# EAGLE design ATtinyNode (EAGLE 9.3.1)
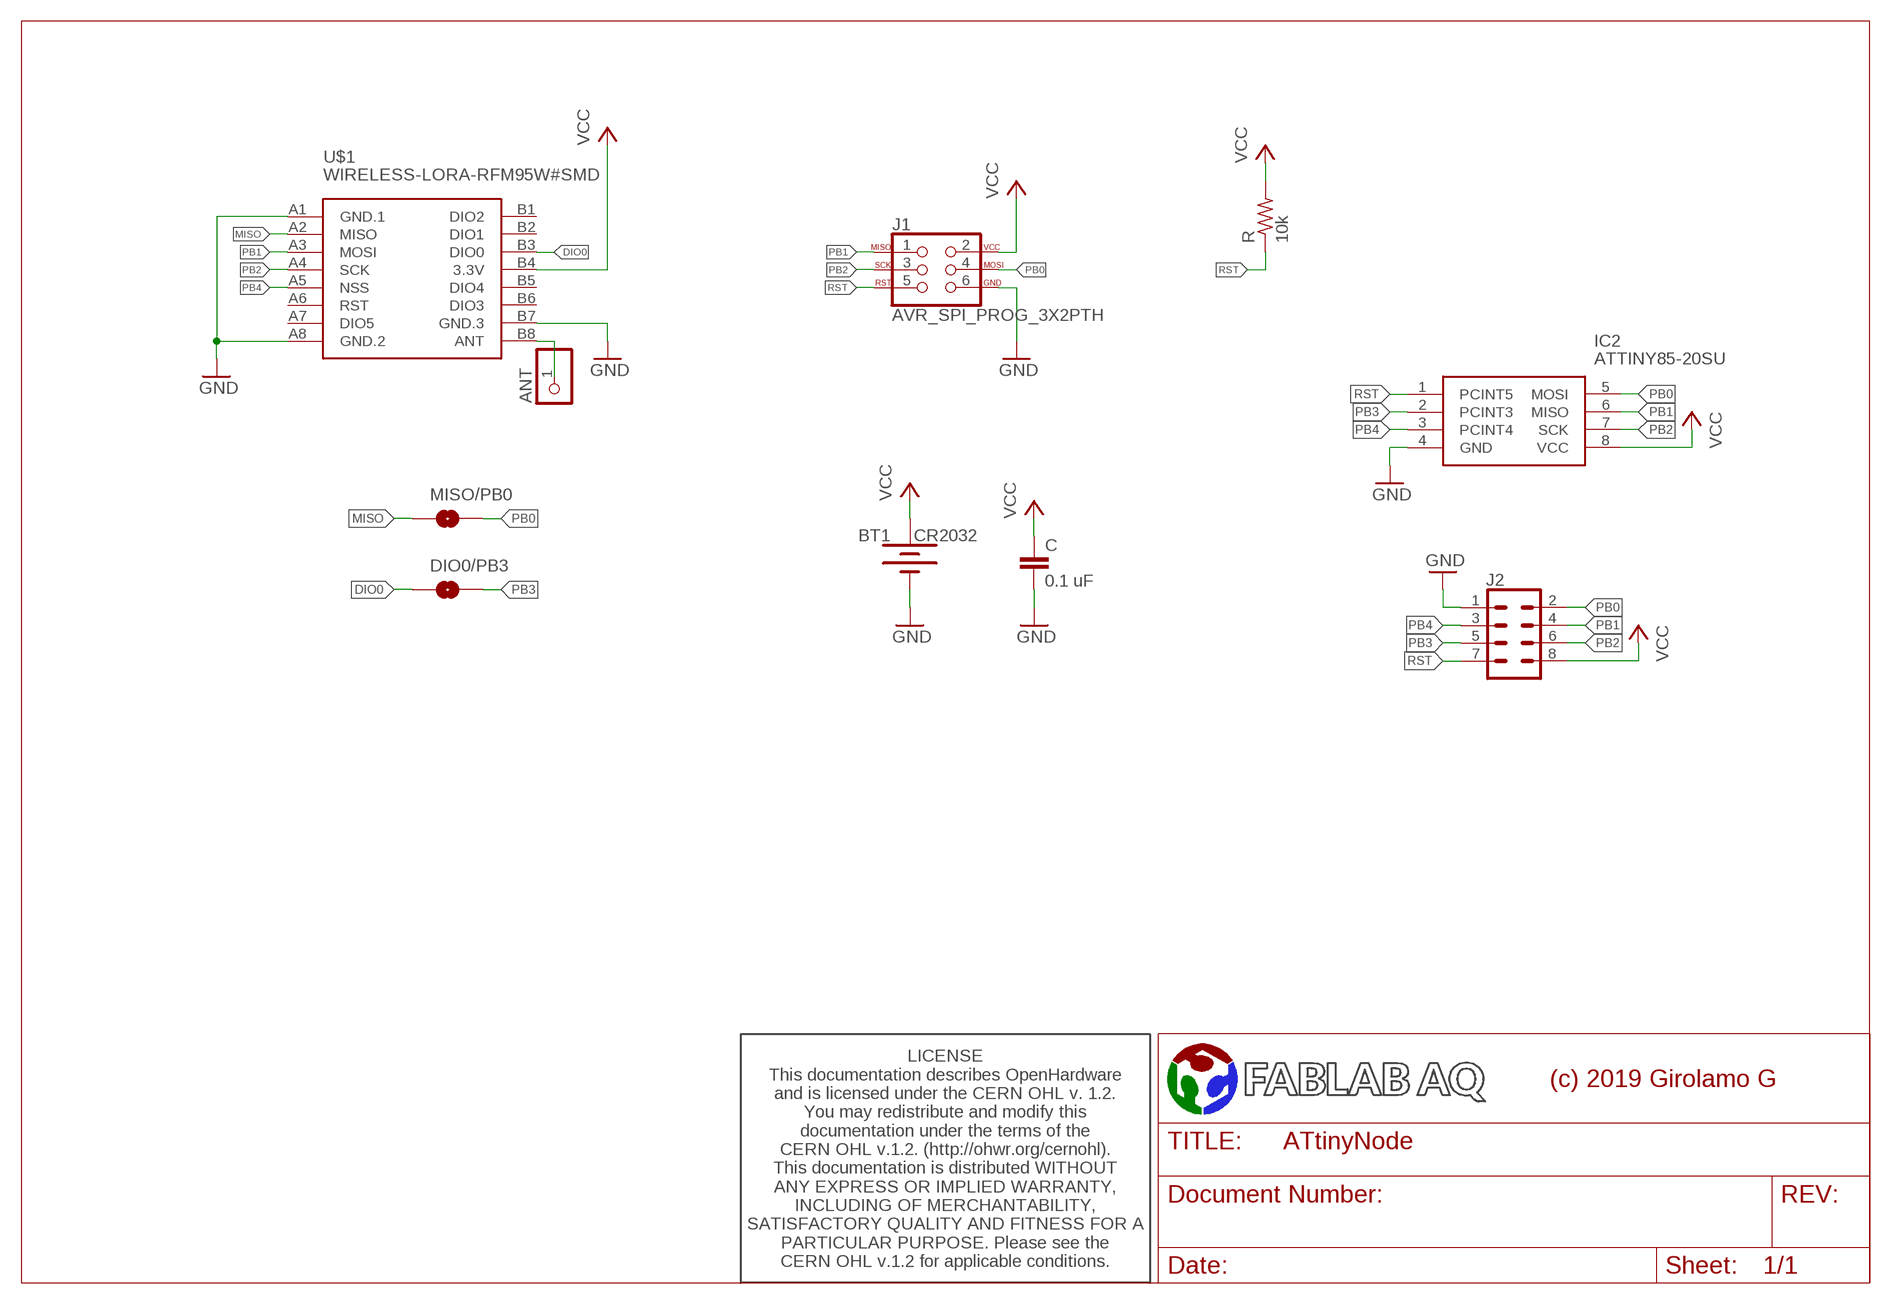
[diagram p0: schematic, sheet 1]

## Parts
ANT  PINHD-1X1CB  [1X01-CLEANBIG]
BT1  CR2032  BATTERY-20MM_PTH  [BATTCOM_20MM_PTH]
C  0.1 uF  C-EUC0805  [C0805]
DIO0/PB3  JUMPER-SMT_2_NO_SILK  [SMT-JUMPER_2_NO_SILK]
IC2  ATTINY85-20SU  [SOT127P798X216-8N]
J1  AVR_SPI_PROG_3X2PTH  [2X3]
J2  CONN_04X2  [2X4]
MISO/PB0  JUMPER-SMT_2_NO_SILK  [SMT-JUMPER_2_NO_SILK]
R  10k  R-US_R0805  [R0805]
U$1  WIRELESS-LORA-RFM95W#SMD  [WIRELESS-LORA-RFM95W#SMD]
U$2  FABLABAQ_LOGONONE  [NONE]
U$3  CERN_OHL_1.2  [DOC_CERN_OHL_1.2]

## Nets
ANT: ANT.1 U$1.B8(ANT)
DIO0: DIO0/PB3.1 U$1.B3(DIO0)
GND: BT1.2(-) C.2 IC2.4(GND) J1.6 J2.1 U$1.A1(GND.1) U$1.A8(GND.2) U$1.B7(GND.3)
MISO: MISO/PB0.1 U$1.A2(MISO)
PB0: IC2.5(MOSI) J1.4 J2.2 MISO/PB0.2
PB1: IC2.6(MISO) J1.1 J2.4 U$1.A3(MOSI)
PB2: IC2.7(SCK) J1.3 J2.6 U$1.A4(SCK)
PB3: DIO0/PB3.2 IC2.2(PCINT3) J2.5
PB4: IC2.3(PCINT4) J2.3 U$1.A5(NSS)
RST: IC2.1(PCINT5) J1.5 J2.7 R.1
VCC: BT1.1(+) C.1 IC2.8(VCC) J1.2 J2.8 R.2 U$1.B4(3.3V)
Unconnected: U$1.A6(RST) U$1.A7(DIO5) U$1.B1(DIO2) U$1.B2(DIO1) U$1.B5(DIO4) U$1.B6(DIO3)

## Notes on the sheet
- (c) 2019 Girolamo G

## Library data of the parts
ANT = adafruit:PINHD-1X1: Pin header 1x1 for 0.1" spacing With round pins
BT1 = SparkFun-Batteries:BATTERY: Battery - Single Cell A variety of battery chemistries, sizes, and footprints. Device List: 20MM_PTH - Coin Cell Battery Holder - 20mm (PTH) <https://www.sparkfun.com/products/783> 6.8MM_PTH - Coin Cell Battery Holder - 6.8MM(SMD) <https://www.digikey.com/product-detail/en/seiko-instruments/MS621FE-FL11E/728-1057-ND/1889208?WT.srch=1&gclid=CNOQ5a6LzdQCFZS2wAodXCkE0g> 12MM_SMD - Coin Cell Battery Holder - 12mm (SMD) <https://www.sparkfun.com/products/10592> 12MM_PTH - Coin Cell Battery Holder - 12mm (PTH) <https://www.sparkfun.com/products/7948> 20MM_SMD - 20mm Coin Cell Battery Holder (SMD) (2 legs) Used on the Big Time Watch Kit <https://www.sparkfun.com/products/11734> 20MM_SMD_4LEGS - Coin Cell Battery Holder - 20mm (SMD) <https://www.sparkfun.com/products/11892> 20MM_SMD_4LEGS_OVERPASTE - Coin Cell Battery Holder - 20mm (SMD) <https://www.sparkfun.com/products/11892> (Over-paste on the legs) 24.5MM_PTH - Coin Cell Battery Holder - 24.5mm (PTH) <https://www.sparkfun.com/products/8863> 9V - 9V Battery Holder - PC Mount Used on the SparkFun SparkPunk Sound Kit <https://www.sparkfun.com/products/11177> and SparkFun SparkPunk Sequencer Kit <https://www.sparkfun.com/products/12707> 18650 - Battery Holder - 18650 (PTH) <https://www.sparkfun.com/products/13113> AA - Battery Holder - 1xAA (PTH) <https://www.sparkfun.com/products/7949> AAA - Battery Holder - 1xAAA (PTH) <https://www.sparkfun.com/products/12718> AA_KIT - Battery Holder - 1xAA (PTH) <https://www.sparkfun.com/products/7949> Special kit package - pads only have exposed copper on one side of the board. AAA_KIT - Battery Holder - 1xAAA (PTH) <https://www.sparkfun.com/products/12718> Special kit package - pads only have exposed copper on one side of the board.; PROD_ID: BATT-09031; SF_SKU: PRT-00783
C = rcl:C-EU: CAPACITOR, European symbol; SPICEPREFIX: C
DIO0/PB3 MISO/PB0 = SparkFun-Jumpers:JUMPER-SMT_2_NO: Normally open jumper This jumper has two pads in close proximity to each other. Apply solder to close the connection. Round pads are easier to solder for beginners, but are a lot larger. SparkFun Product that uses the round pads: SparkFun EL Sequencer <https://www.sparkfun.com/products/12781>
IC2 = ATTINY85-20SU:ATTINY85-20SU: MICROCHIP - ATTINY85-20SU - MICROCONTROLLER MCU, 8 BIT, ATTINY, 20MHZ, SOIC-8 Source: Datasheet <https://componentsearchengine.com/Datasheets/2/ATTINY85-20SU.pdf>; DESCRIPTION: MICROCHIP - ATTINY85-20SU - MICROCONTROLLER MCU, 8 BIT, ATTINY, 20MHZ, SOIC-8; HEIGHT: 2.16mm; MANUFACTURER_NAME: Microchip; MANUFACTURER_PART_NUMBER: ATTINY85-20SU; MOUSER_PART_NUMBER: 556-ATTINY85-20SU; MOUSER_PRICE-STOCK: https://www.mouser.com/Search/Refine.aspx?Keyword=556-ATTINY85-20SU; RS_PART_NUMBER: 1331674; RS_PRICE-STOCK: http://uk.rs-online.com/web/p/products/1331674
J1 = SparkFun-Connectors:AVR_SPI_PROG_3X2: AVR ISP 6 Pin This is the reduced ISP connector for AVR programming. Common on Arduino. This footprint will take up less PCB space and can be used with a 10-pin to 6-pin adapter such as SKU: BOB-08508 **Special note about "TEST_POINT" package. The stop mask is on the top side, so if you want your programming test points to be on the bottom of your board, make sure to place this package on the bottom side of the board. This also ensure that the orientation to program from the bottom side will be correct. SparkFun Products: SparkFun ISP Pogo Adapter <https://www.sparkfun.com/products/11591> - NS Tiny AVR Programmer <https://www.sparkfun.com/products/11801> -PTH
J2 = SparkFun-Connectors:CONN_04X2: Multi connection point. Often used as Generic Header-pin footprint for 0.1 inch spaced/style header connections On any of the 0.1 inch spaced packages, you can populate with these: Break Away Headers - Straight <https://www.sparkfun.com/products/116> (PRT-00116) Break Away Male Headers - Right Angle <https://www.sparkfun.com/products/553> (PRT-00553) Female Headers <https://www.sparkfun.com/products/115> (PRT-00115) Break Away Headers - Machine Pin <https://www.sparkfun.com/products/117> (PRT-00117) Break Away Female Headers - Swiss Machine Pin <https://www.sparkfun.com/products/743> (PRT-00743)
R = rcl:R-US_: RESISTOR, American symbol; SPICEPREFIX: R
U$1 = diy-modules:WIRELESS-LORA-RFM95W: 868/915 MHz LoRa Radio Transceiver Module based on SX1276 chip Click here to find device on ebay.com <http://www.ebay.com/sch/RFM95W+transceiver>
U$2 = FabLab eagle logo:FABLABAQ_LOGO
U$3 = CERN_OHL_1.2:CERN_OHL_1.2

## Board
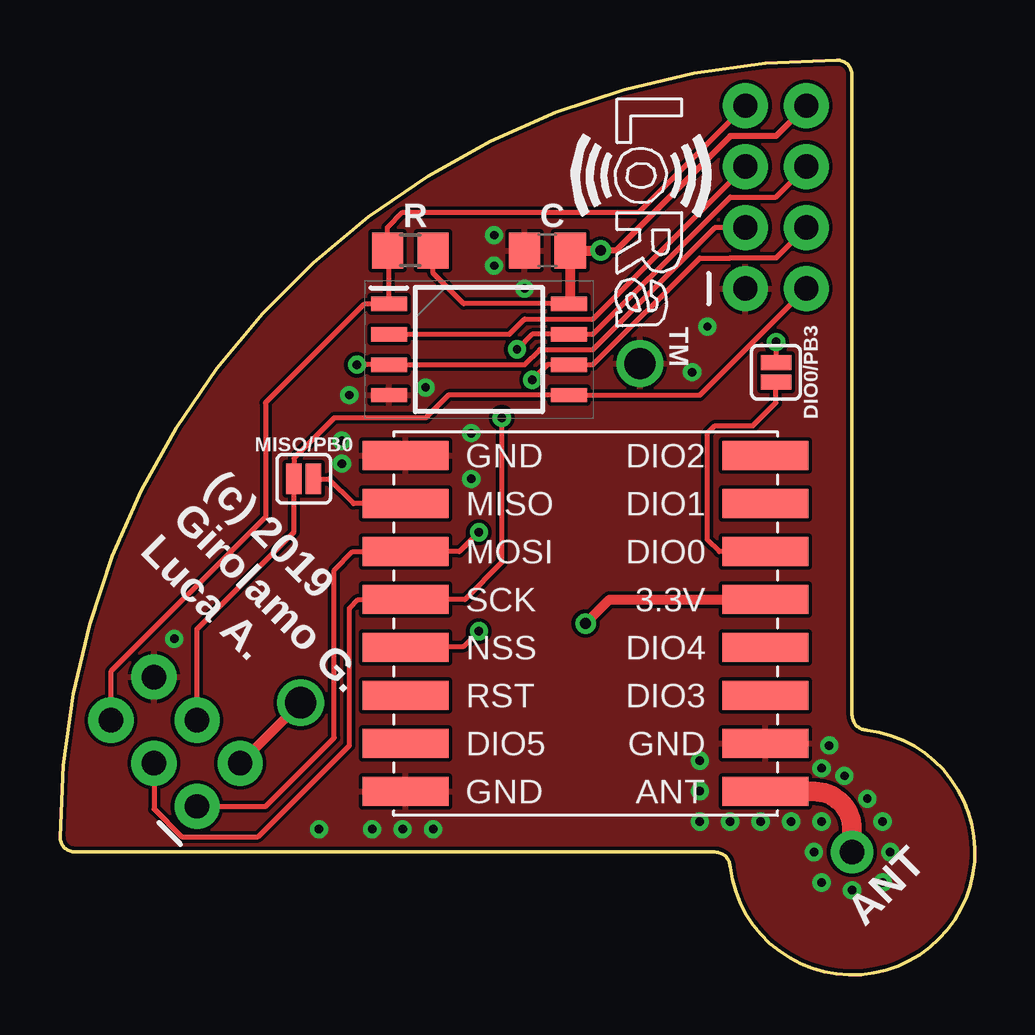
[diagram p1: board, top side]
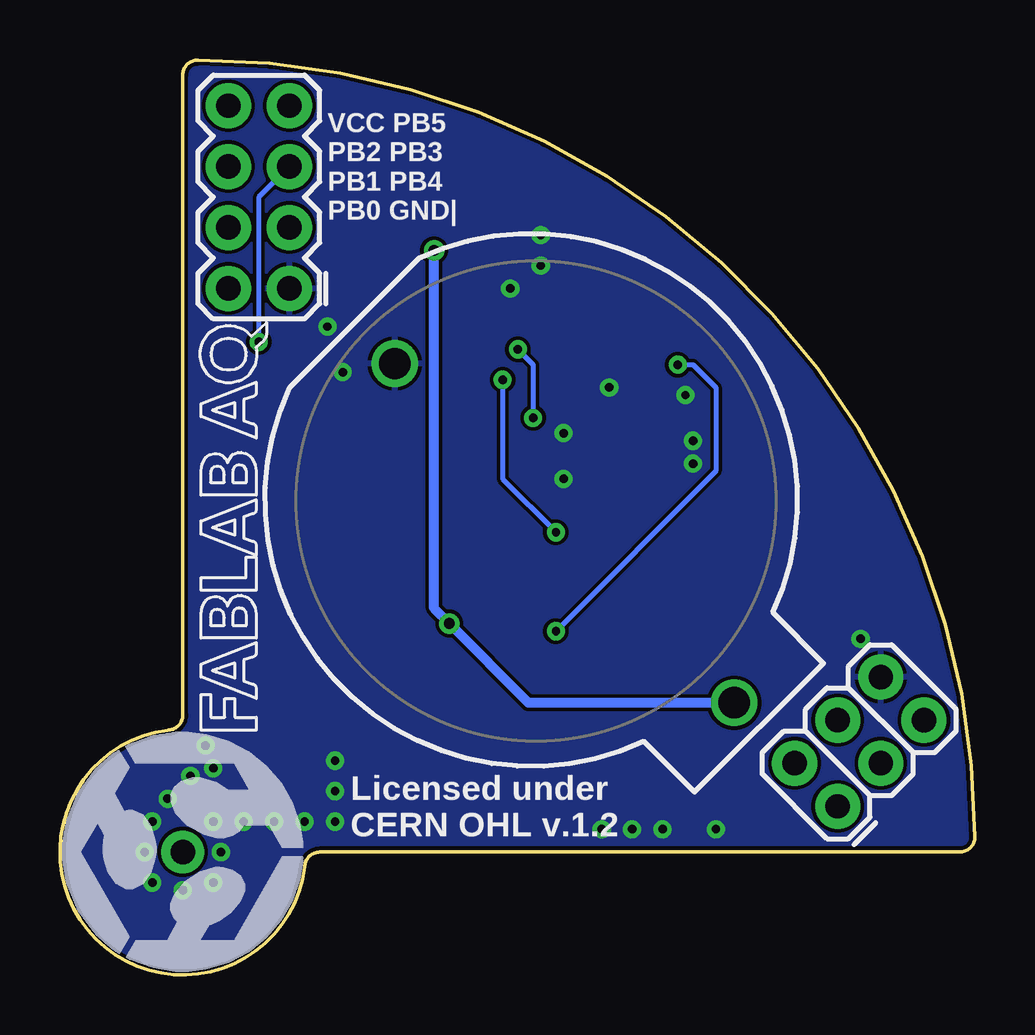
[diagram p2: board, bottom side, seen from below]

Size 38.14 x 38.14 mm. Coordinates in mm from the lower left corner, seen from the top.
Outline: 0,5.75 arc-90 32.39,38.14 arc-90 33.02,37.5 33.02,10.83 arc90 33.66,10.2 arc-256 27.94,4.48 arc90 27.31,5.12 0.64,5.12 arc-90 0,5.75
Copper layers (1*16): Top 0.035mm / dielectric 1.5mm / Bottom 0.035mm
Design rules "default *": minimum track width 6mil, minimum drill 0.35mm, track to track 6mil, track to pad 8mil, pad to pad 6mil, via to via 6mil, smd to smd 6mil, copper to edge 6mil, drill to drill 6mil, minimum pad ring 10mil, minimum via ring 8mil, stop-mask expansion 4mil, vias tented up to drill 0.5mm, thermal gap 6mil

### Footprints (pad centres in the part's own frame; a part is rotated, then mirrored left to right if it is on the bottom)
1X01-CLEANBIG = drill 1.016 pad 1.778: 1 0,0
BATTCOM_20MM_PTH = drill 1.3: 1 11.85,0; 2 -8.15,0
C0805 = smd 1.3 x 1.5: 1 -0.95,0; 2 0.95,0
SMT-JUMPER_2_NO_SILK = smd 0.635 x 1.27: 1 -0.406,0; 2 0.406,0
SOT127P798X216-8N = smd 1.5 x 0.6: 1 -3.75,1.905; 2 -3.75,0.635; 3 -3.75,-0.635; 4 -3.75,-1.905; 5 3.75,-1.905; 6 3.75,-0.635; 7 3.75,0.635; 8 3.75,1.905
2X3 = drill 1.016 pad 1.88: 1 0,0; 2 0,2.54; 3 2.54,0; 4 2.54,2.54; 5 5.08,0; 6 5.08,2.54
2X4 = drill 1.016 pad 1.88: 1 -3.81,-1.27; 2 -3.81,1.27; 3 -1.27,-1.27; 4 -1.27,1.27; 5 1.27,-1.27; 6 1.27,1.27; 7 3.81,-1.27; 8 3.81,1.27
R0805 = smd 1.3 x 1.5: 1 -0.95,0; 2 0.95,0
WIRELESS-LORA-RFM95W#SMD = smd 3.6 x 1.2: A1 -7.5,7; A2 -7.5,5; A3 -7.5,3; A4 -7.5,1; A5 -7.5,-1; A6 -7.5,-3; A7 -7.5,-5; A8 -7.5,-7; B1 7.5,7; B2 7.5,5; B3 7.5,3; B4 7.5,1; B5 7.5,-1; B6 7.5,-3; B7 7.5,-5; B8 7.5,-7

### Placement (x,y rotation side)
ANT  33.02,5.12 45 top
BT1  18.42,19.72 315 bottom
C  20.32,30.2 180 top
DIO0/PB3  29.85,25.12 90 top
IC2  17.46,26.07 0 top
J1  5.72,7.02 45 bottom
J2  29.85,32.42 90 bottom
MISO/PB0  10.16,20.68 180 top
R  14.61,30.2 0 top
U$1  21.91,14.64 0 top
U$2  34.29,11.47 0 bottom
U$3  18.42,19.72 0 top

### Tracks (layer width: path | path; a pad name or v marks a point on that pad's centre or on a via)
ANT
  Top 0.813: U$1.B8 31.45,7.64 arc-90 33.02,6.07 ANT.1
DIO0
  Top 0.203: U$1.B3 27.48,17.64 26.99,18.14 26.99,22.58 27.31,22.9 28.89,22.9 29.85,23.85 DIO0/PB3.1
GND  (via drill 0.35)
  other vias: 12.07,24.17 31.75,6.39 34.29,6.39 13.02,6.07 33.66,7.34 32.7,8.29 31.75,8.61 32.07,9.56 33.02,3.53 31.43,5.12 34.61,5.12 34.29,3.85 31.75,3.85 30.48,6.39 29.21,6.39 27.94,6.39 26.67,6.39 26.67,7.66 26.67,8.93 14.29,6.07 15.56,6.07 10.8,6.07 4.76,14.01 11.75,21.31 11.75,22.26 17.15,20.68 17.15,22.58 18.1,30.84 18.1,29.57 19.37,28.61 26.99,27.03 26.35,25.12 15.24,24.49
  pour Bottom (isolate 0.152): 0,5.12 arc-90 33.02,38.14 33.02,10.2 arc-270 27.94,5.12
  pour Top (isolate 0.152): 0,5.12 arc-90 33.02,38.14 33.02,10.2 arc-270 27.94,5.12
MISO
  Top 0.203: U$1.A2 12.23,19.64 11.2,20.67 MISO/PB0.1
PB0
  Top 0.203: J2.2 26.67,24.17 IC2.5 16.19,24.17 15.24,23.22 11.43,23.22 9.75,21.54 MISO/PB0.2 9.75,18.46 5.72,14.42 J1.4
PB1  (via drill 0.35)
  Top 0.203: J2.4 29.85,29.88 27.94,29.88 26.67,29.88 22.23,25.44 IC2.6 20.32,25.44 v19.69,24.8 | J1.1 8.57,7.02 11.43,9.88 11.43,16.87 12.21,17.64 U$1.A3 16.65,17.64 v17.46,18.45
  Bottom 0.203: v19.69,24.8 19.69,20.67 v17.46,18.45
PB2  (via drill 0.35)
  Top 0.203: J2.6 29.85,32.42 27.94,32.42 26.99,31.47 22.23,26.71 IC2.7 19.69,26.71 v19.05,26.07 | J1.3 3.92,6.91 5.08,5.75 8.26,5.75 12.07,9.56 12.07,15.28 12.43,15.64 U$1.A4 16.88,15.64 18.42,17.18 v18.42,23.22
  Bottom 0.203: v19.05,26.07 18.42,25.44 v18.42,23.22
PB3  (via drill 0.35)
  Top 0.203: v29.85,26.38 DIO0/PB3.2 | IC2.2 18.73,26.71 19.37,27.34 22.23,27.34 J2.5
  Bottom 0.203: J2.5 29.85,32.42 v29.85,26.38
PB4  (via drill 0.35)
  Top 0.203: U$1.A5 14.46,13.69 16.83,13.69 v17.46,14.32 | J2.3 27.31,31.15 22.23,26.07 20,26.07 19.37,25.44 IC2.3 v12.38,25.44
  Bottom 0.203: v12.38,25.44 11.75,25.44 10.8,24.48 10.8,20.99 v17.46,14.32
RST
  Top 0.203: J2.7 24.13,31.79 14.29,31.79 13.65,31.15 13.66,31.15 R.1 13.71,30.14 IC2.1 12.7,27.98 8.57,23.85 8.57,19.09 2.12,12.64 J1.5
VCC  (via drill 0.45)
  Top 0.203: IC2.8 16.83,27.98 15.56,29.25 R.2
  Top 0.254: J2.8 29.85,34.96 27.94,34.96 23.18,30.2 v22.54,30.2
  Top 0.406: v21.91,14.64 22.91,15.64 U$1.B4 | v22.54,30.2 C.1 21.27,28.04 IC2.8 | J1.2 BT1.1
  Bottom 0.406: BT1.1 18.61,11.34 v21.91,14.64 22.54,15.28 v22.54,30.2

### Text on the board
tPlace: TM | (c) 2019 / Girolamo G. / Luca A.
bPlace: VCC PB5 / PB2 PB3 / PB1 PB4 / PB0 GND| | Licensed under / CERN OHL v.1.2